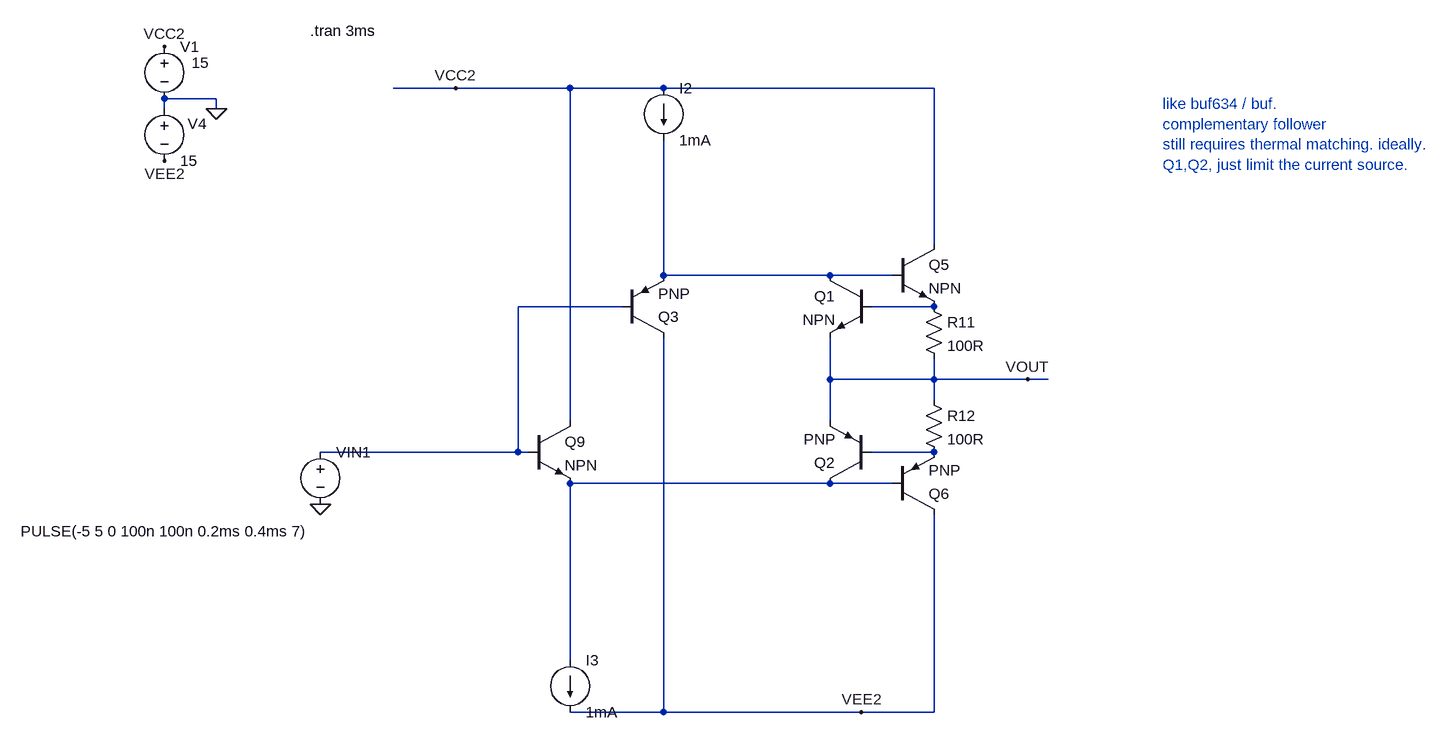
[diagram p0: schematic Draft44.asc]
Draft44.asc, the LTspice schematic file:
Version 4
SHEET 1 2064 952
WIRE 384 -192 288 -192
WIRE 560 -192 384 -192
WIRE 704 -192 560 -192
WIRE 1120 -192 704 -192
WIRE 16 -176 -64 -176
WIRE -64 -160 -64 -176
WIRE 16 -160 16 -176
WIRE 1120 48 1120 -192
WIRE 704 96 704 -112
WIRE 960 96 704 96
WIRE 1056 96 960 96
WIRE 640 144 480 144
WIRE 1120 144 1024 144
WIRE 960 256 960 192
WIRE 1120 256 1120 224
WIRE 1120 256 960 256
WIRE 1264 256 1120 256
WIRE 1296 256 1264 256
WIRE 1120 288 1120 256
WIRE 560 320 560 -192
WIRE 960 320 960 256
WIRE 480 368 480 144
WIRE 480 368 176 368
WIRE 496 368 480 368
WIRE 1120 368 1024 368
WIRE 960 416 560 416
WIRE 1056 416 960 416
WIRE 560 688 560 416
WIRE 704 768 704 192
WIRE 704 768 560 768
WIRE 1008 768 704 768
WIRE 1120 768 1120 464
WIRE 1120 768 1008 768
FLAG 16 -160 0
FLAG -64 -256 VCC2
FLAG -64 -80 VEE2
FLAG 384 -192 VCC2
FLAG 1008 768 VEE2
FLAG 1264 256 VOUT
FLAG 176 448 0
SYMBOL voltage -64 -272 R0
WINDOW 123 0 0 Left 0
WINDOW 39 0 0 Left 0
WINDOW 3 42 41 Left 2
SYMATTR Value 15
SYMATTR InstName V1
SYMBOL voltage -64 -176 R0
WINDOW 123 0 0 Left 0
WINDOW 39 0 0 Left 0
WINDOW 0 36 39 Left 2
SYMATTR InstName V4
SYMATTR Value 15
SYMBOL npn 1056 48 R0
SYMATTR InstName Q5
SYMBOL res 1104 128 R0
SYMATTR InstName R11
SYMATTR Value 100R
SYMBOL res 1104 272 R0
SYMATTR InstName R12
SYMATTR Value 100R
SYMBOL pnp 1056 464 M180
SYMATTR InstName Q6
SYMBOL voltage 176 352 R0
WINDOW 123 0 0 Left 0
WINDOW 39 0 0 Left 0
WINDOW 3 -461 138 Left 2
SYMATTR Value PULSE(-5 5 0 100n 100n 0.2ms 0.4ms 7)
SYMATTR InstName VIN1
SYMBOL current 704 -192 R0
WINDOW 123 0 0 Left 0
WINDOW 39 0 0 Left 0
SYMATTR InstName I2
SYMATTR Value 1mA
SYMBOL npn 1024 96 M0
SYMATTR InstName Q1
SYMBOL pnp 1024 416 R180
SYMATTR InstName Q2
SYMBOL pnp 640 192 M180
SYMATTR InstName Q3
SYMBOL npn 496 320 R0
SYMATTR InstName Q9
SYMBOL current 560 688 R0
WINDOW 123 0 0 Left 0
WINDOW 39 0 0 Left 0
SYMATTR InstName I3
SYMATTR Value 1mA
TEXT 160 -280 Left 2 !.tran 3ms
TEXT 1472 -168 Left 2 ;like buf634 / buf.\ncomplementary follower\nstill requires thermal matching. ideally.\nQ1,Q2, just limit the current source.

The netlist it stands for:
* Draft44.asc
V1 VCC2 0 15
V4 0 VEE2 15
Q5 VCC2 N001 N003 0 NPN
R11 N003 VOUT 100R
R12 VOUT N004 100R
Q6 VEE2 N005 N004 0 PNP
VIN1 N002 0 PULSE(-5 5 0 100n 100n 0.2ms 0.4ms 7)
I2 VCC2 N001 1mA
Q1 N001 N003 VOUT 0 NPN
Q2 N005 N004 VOUT 0 PNP
Q3 VEE2 N002 N001 0 PNP
Q9 VCC2 N002 N005 0 NPN
I3 N005 VEE2 1mA
.model NPN NPN
.model PNP PNP
.lib standard.bjt
.tran 3ms
* like buf634 / buf.
* complementary follower
* still requires thermal matching. ideally.
* Q1,Q2, just limit the current source.
.backanno
.end